# Altium schematic sheet FAT44_1.SchDoc
size A4
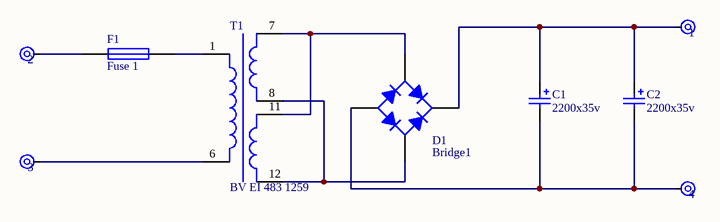
[diagram p0: FAT44_1.SchDoc]

## Parts
1  Socket_Ring  [PIN1]  (value not drawn)
2  Socket_Ring  [PIN1]  (value not drawn)
3  Socket_Ring  [PIN1]  (value not drawn)
4  Socket_Ring  [PIN1]  (value not drawn)
C1  value 2200x35v  [el8]
C2  value 2200x35v  [el8]
D1  Bridge1  [GSIB2580]
F1  Fuse 1  [FUSE3]
T1  BV EI 483 1259  [BV EI 483 1259_LUT]

## Nets
Net1_1: 1.1 C1.1 C2.1 D1.3(K)
Net2_1: 2.1 F1.1
Net3_1: 3.1 T1.6(Pri-)
Net4_1: 4.1 C1.2 C2.2 D1.1(A)
NetD1_2: D1.2(C) T1.7(Sec1+) T1.11(Sec1+)
NetD1_4: D1.4(C) T1.8(Sec1-) T1.12(Sec1-)
NetF1_2: F1.2 T1.1(Pri+)

## Library data of the parts
1-4 = Socket_Ring: Socket; Manufacturer: Generic Components; Class I: Connector; Revision: July-2002: Re-released for DXP Platform.; Publisher: Altium Limited
C1 C2 = Cap Pol1: Polarized Capacitor (Radial); Manufacturer: Generic Components; Class I: Passive; Published: 8-Jun-2000; Revision: July-2002: Re-released for DXP Platform.; Publisher: Altium Limited; Class II: Capacitor
D1 = Bridge1: Full Wave Diode Bridge; Manufacturer: Generic Components; Class I: Discrete; Class II: Rectifier - Bridge; Published: 8-Jun-2000; Revision: July-2002: Re-released for DXP Platform.; Publisher: Altium Limited
F1 = Fuse 1: Fuse; Manufacturer: Generic Components; Class I: Passive; Published: 8-Jun-2000; Revision: July-2002: Re-released for DXP Platform.; Publisher: Altium Limited; Class II: Fuse
T1 = BV EI 483 1259: Manufacturer: Generic Components; Class I: Passive; Class II: Transformer; Published: 25-Jan-2001; Revision: July-2002: Re-released for DXP Platform.; Publisher: Altium Limited